# Altium schematic sheet Transistors.SchDoc
size A3; SheetNumber: 2; SheetTotal: 4
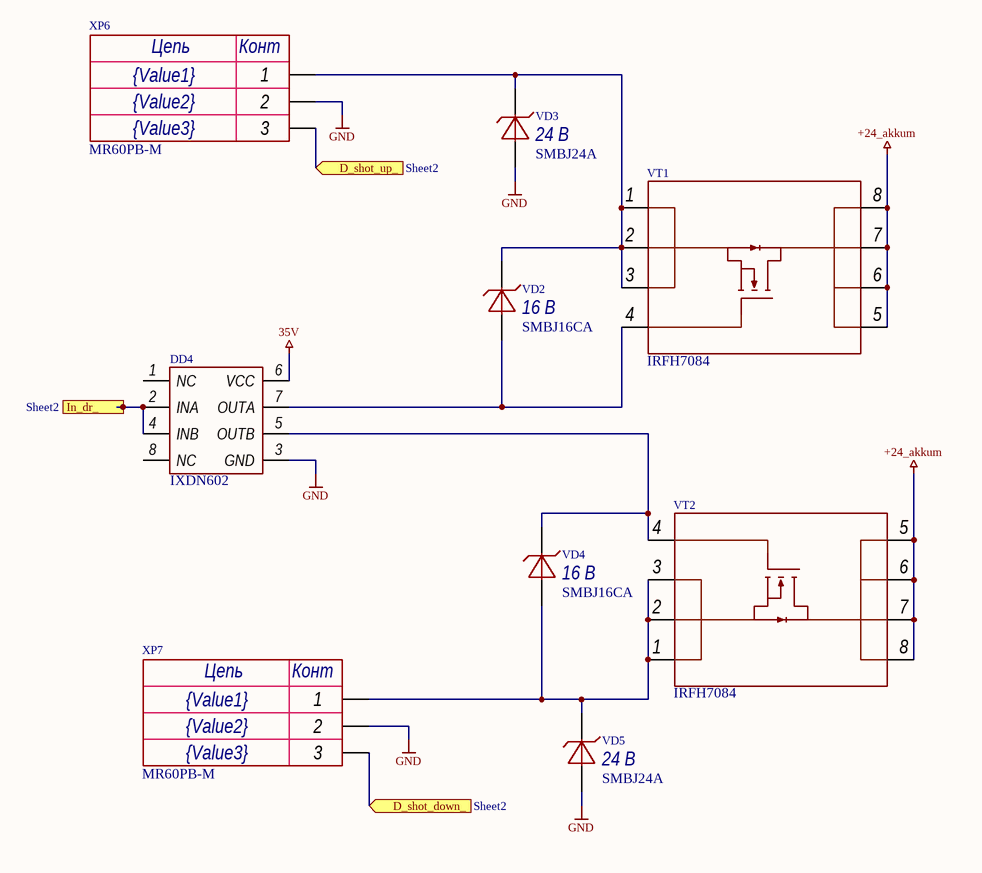
[diagram p0: Transistors.SchDoc]

## Parts
DD4  IXDN602  [SOIC-8]
VD2  SMBJ16CA  value 16 В  [SMB]
VD3  SMBJ24A  value 24 В  [SMB]
VD4  SMBJ16CA  value 16 В  [SMB]
VD5  SMBJ24A  value 24 В  [SMB]
VT1  IRFH7084  [PQFN_5x6]
VT2  IRFH7084  [PQFN_5x6]
XP6  MR60PB-M  Value3: {Value3}  Value2: {Value2}  Value1: {Value1}  [MR60PB-M]
XP7  MR60PB-M  Value3: {Value3}  Value2: {Value2}  Value1: {Value1}  [MR60PB-M]

## Ports
D_shot_down_ (in, see Sheet2), D_shot_up_ (in, see Sheet2), In_dr_ (in, see Sheet2)

## Nets
35V: DD4.6(VCC)
+24_akkum: VT1.5 VT1.6 VT1.7 VT1.8 VT2.5 VT2.6 VT2.7 VT2.8
GND: DD4.3(GND) VD3.1 VD5.1 XP6.2 XP7.2
D_shot_down_: XP7.3 ; port D_shot_down_
D_shot_up_: XP6.3 ; port D_shot_up_
In_dr_: DD4.2(INA) DD4.4(INB) ; port In_dr_
NetDD4_5: DD4.5(OUTB) VD4.2 VT2.4
NetDD4_7: DD4.7(OUTA) VD2.1 VT1.4
NetVD2_2: VD2.2 VD3.2 VT1.1 VT1.2 VT1.3 XP6.1
NetVD4_1: VD4.1 VD5.2 VT2.1 VT2.2 VT2.3 XP7.1

Not connected (* = marked no-connect by the designer): DD4 1(NC) 8(NC)

## Notes on the sheet
- (in symbol MR60PB-M) Цепь; Конт

## Library data of the parts
DD4 = IXDN602: Двухканальный драйвер затвора для mosfet и igbt транзисторов; Part Number: IXDN602
VD2 VD4 = SMBJ16CA: Защитный диод двунаправленный 600Вт 16В; Voltage nominal (V): 16; Power (W): 600; Part Number: SMBJ16CA
VD3 VD5 = SMBJ24A: Защитный диод на 24 В, рассеиваемая мощность 600 Вт; Voltage nominal (V): 24; Power (W): 600; Part Number: SMBJ24A
VT1 VT2 = IRFH7084: N-канальный MOSFET; Напряжение С-И/К-Э: 40 В; Ток макс#: 100 А; Part Number: IRFH7084
XP6 XP7 = MR60PB-M: 60 А (40 продолжительно), 3 контакта, прямой отец; Part Number: MR60PB-M